# Altium schematic sheet SPD.SchDoc
size A3
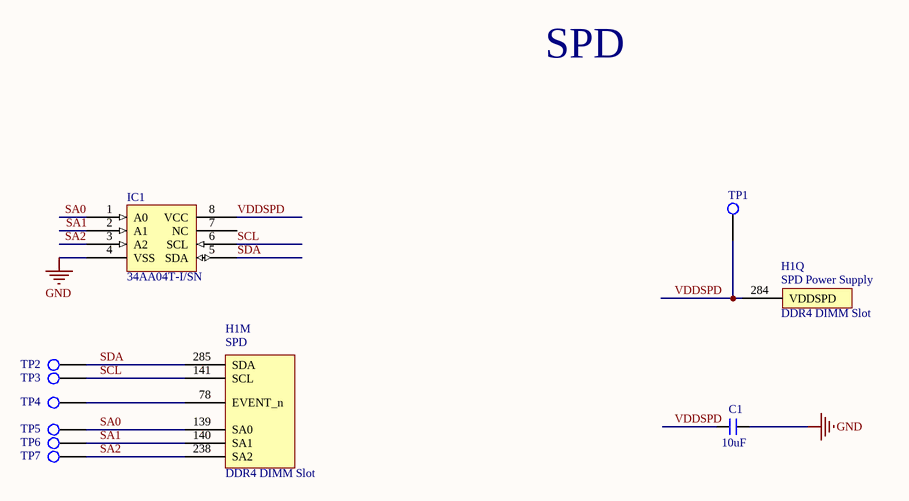
[diagram p0: SPD.SchDoc]

## Parts
C1  Capacitance: 10uF  [Capacitor 0603]  (hidden comment: Capacitor 0603)
H1  DDR4 DIMM Slot  [DDR4 DIMM]  (parts M,Q of 21)
IC1  34AA04T-I/SN  [34AA04T-I/SN]
TP1  Test Point  [Test Point]  (value not drawn)
TP2  Test Point  [Test Point]  (value not drawn)
TP3  Test Point  [Test Point]  (value not drawn)
TP4  Test Point  [Test Point]  (value not drawn)
TP5  Test Point  [Test Point]  (value not drawn)
TP6  Test Point  [Test Point]  (value not drawn)
TP7  Test Point  [Test Point]  (value not drawn)

## Nets
GND: C1.2 IC1.4(VSS)
SA0: H1.139(SA0) IC1.1(A0) TP5.1
SA1: H1.140(SA1) IC1.2(A1) TP6.1
SA2: H1.238(SA2) IC1.3(A2) TP7.1
SCL: H1.141(SCL) IC1.6(SCL) TP3.1
SDA: H1.285(SDA) IC1.5(SDA) TP2.1
VDDSPD: C1.1 H1.284(VDDSPD) IC1.8(VCC) TP1.1
NetH1_78: H1.78(EVENT_n) TP4.1

Not connected (* = marked no-connect by the designer): IC1 7(NC)

## Notes on the sheet
- SPD
- (in symbol DDR4 DIMM Slot, part M) SPD
- (in symbol DDR4 DIMM Slot, part Q) SPD Power Supply

## Library data of the parts
C1 = Capacitor 0603: Manufacturer: Vishay; Manufacturer Part Number: CRCW060310K0FKEA; Max Power Dissipation: 100mW; Tolerance: 1%; Voltage Rating: 75V; Temperature Coefficient: 100ppm/°C; Supplier 1: Avnet Europe; Stock 1: 305000; Pricing 1: 5000=0.00444, 10000=0.00432, 20000=0.00421, 30000=0.0041, 40000=0.004 (EUR); Case/Package: 0603; Number of Pins: 2; Weight: 7.1E-05oz; Contact Plating: Tin,Lead; Case Code (Metric): 1608; Case Code (Imperial): 0603; Min Operating Temperature: -55°C; Max Operating Temperature: 155°C; Packaging: Tape and Reel; Package Quantity: 10; Termination: SMD/SMT; Power Rating: 100mW; Composition: Thick Film; Number of Terminations: 2; Military Standard: Not; Voltage Rating (DC): 75V; Features: Automotive AEC-Q200; Length: 1.55mm; Height: 0.45mm; Width: 0.033inch; Depth: 0.85mm; Radiation Hardening: No; REACH SVHC: Unknown; Lead Free: Lead Free